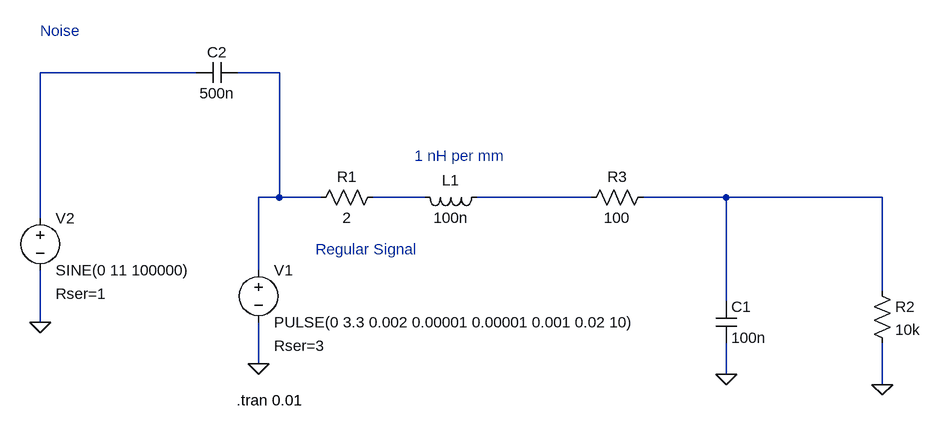
[diagram p0: schematic RC Noise.asc]
RC Noise.asc, the LTspice schematic file:
Version 4
SHEET 1 880 680
WIRE -528 -208 -768 -208
WIRE -400 -208 -464 -208
WIRE -400 -16 -400 -208
WIRE -400 -16 -432 -16
WIRE -336 -16 -400 -16
WIRE -176 -16 -256 -16
WIRE 80 -16 -96 -16
WIRE 288 -16 160 -16
WIRE 528 -16 288 -16
WIRE -768 16 -768 -208
WIRE -432 96 -432 -16
WIRE 528 128 528 -16
WIRE 288 144 288 -16
WIRE -768 176 -768 96
WIRE -432 240 -432 176
WIRE 288 256 288 208
WIRE 528 272 528 208
FLAG 288 256 0
FLAG 528 272 0
FLAG -432 240 0
FLAG -768 176 0
SYMBOL res -240 -32 R90
WINDOW 0 0 56 VBottom 0
WINDOW 3 32 56 VTop 0
SYMATTR InstName R1
SYMATTR Value 2
SYMBOL voltage -432 80 R0
WINDOW 123 0 0 Left 0
WINDOW 39 24 132 Left 0
SYMATTR InstName V1
SYMATTR Value PULSE(0 3.3 0.002 0.00001 0.00001 0.001 0.02 10)
SYMATTR SpiceLine Rser=3
SYMBOL res 512 112 R0
SYMATTR InstName R2
SYMATTR Value 10k
SYMBOL cap 272 144 R0
SYMATTR InstName C1
SYMATTR Value 100n
SYMBOL ind -80 -32 R90
WINDOW 0 5 56 VBottom 0
WINDOW 3 32 56 VTop 0
SYMATTR InstName L1
SYMATTR Value 100n
SYMBOL voltage -768 0 R0
WINDOW 123 0 0 Left 0
WINDOW 39 24 132 Left 0
SYMATTR InstName V2
SYMATTR Value SINE(0 11 100000)
SYMATTR SpiceLine Rser=1
SYMBOL cap -464 -224 R90
WINDOW 0 0 32 VBottom 0
WINDOW 3 32 32 VTop 0
SYMATTR InstName C2
SYMATTR Value 500n
SYMBOL res 176 -32 R90
WINDOW 0 0 56 VBottom 0
WINDOW 3 32 56 VTop 0
SYMATTR InstName R3
SYMATTR Value 100
TEXT -466 296 Left 0 !.tran 0.01
TEXT -768 -272 Left 0 ;Noise
TEXT -344 64 Left 0 ;Regular Signal
TEXT -192 -80 Left 0 ;1 nH per mm

The netlist it stands for:
* RC Noise.asc
R1 N003 N002 2
V1 N002 0 PULSE(0 3.3 0.002 0.00001 0.00001 0.001 0.02 10) Rser=3
R2 N005 0 10k
C1 N005 0 100n
L1 N004 N003 100n
V2 N001 0 SINE(0 11 100000) Rser=1
C2 N002 N001 500n
R3 N005 N004 100
.tran 0.01
* Noise
* Regular Signal
* 1 nH per mm
.backanno
.end